# EAGLE design LED Controller (EAGLE 9.6.2)
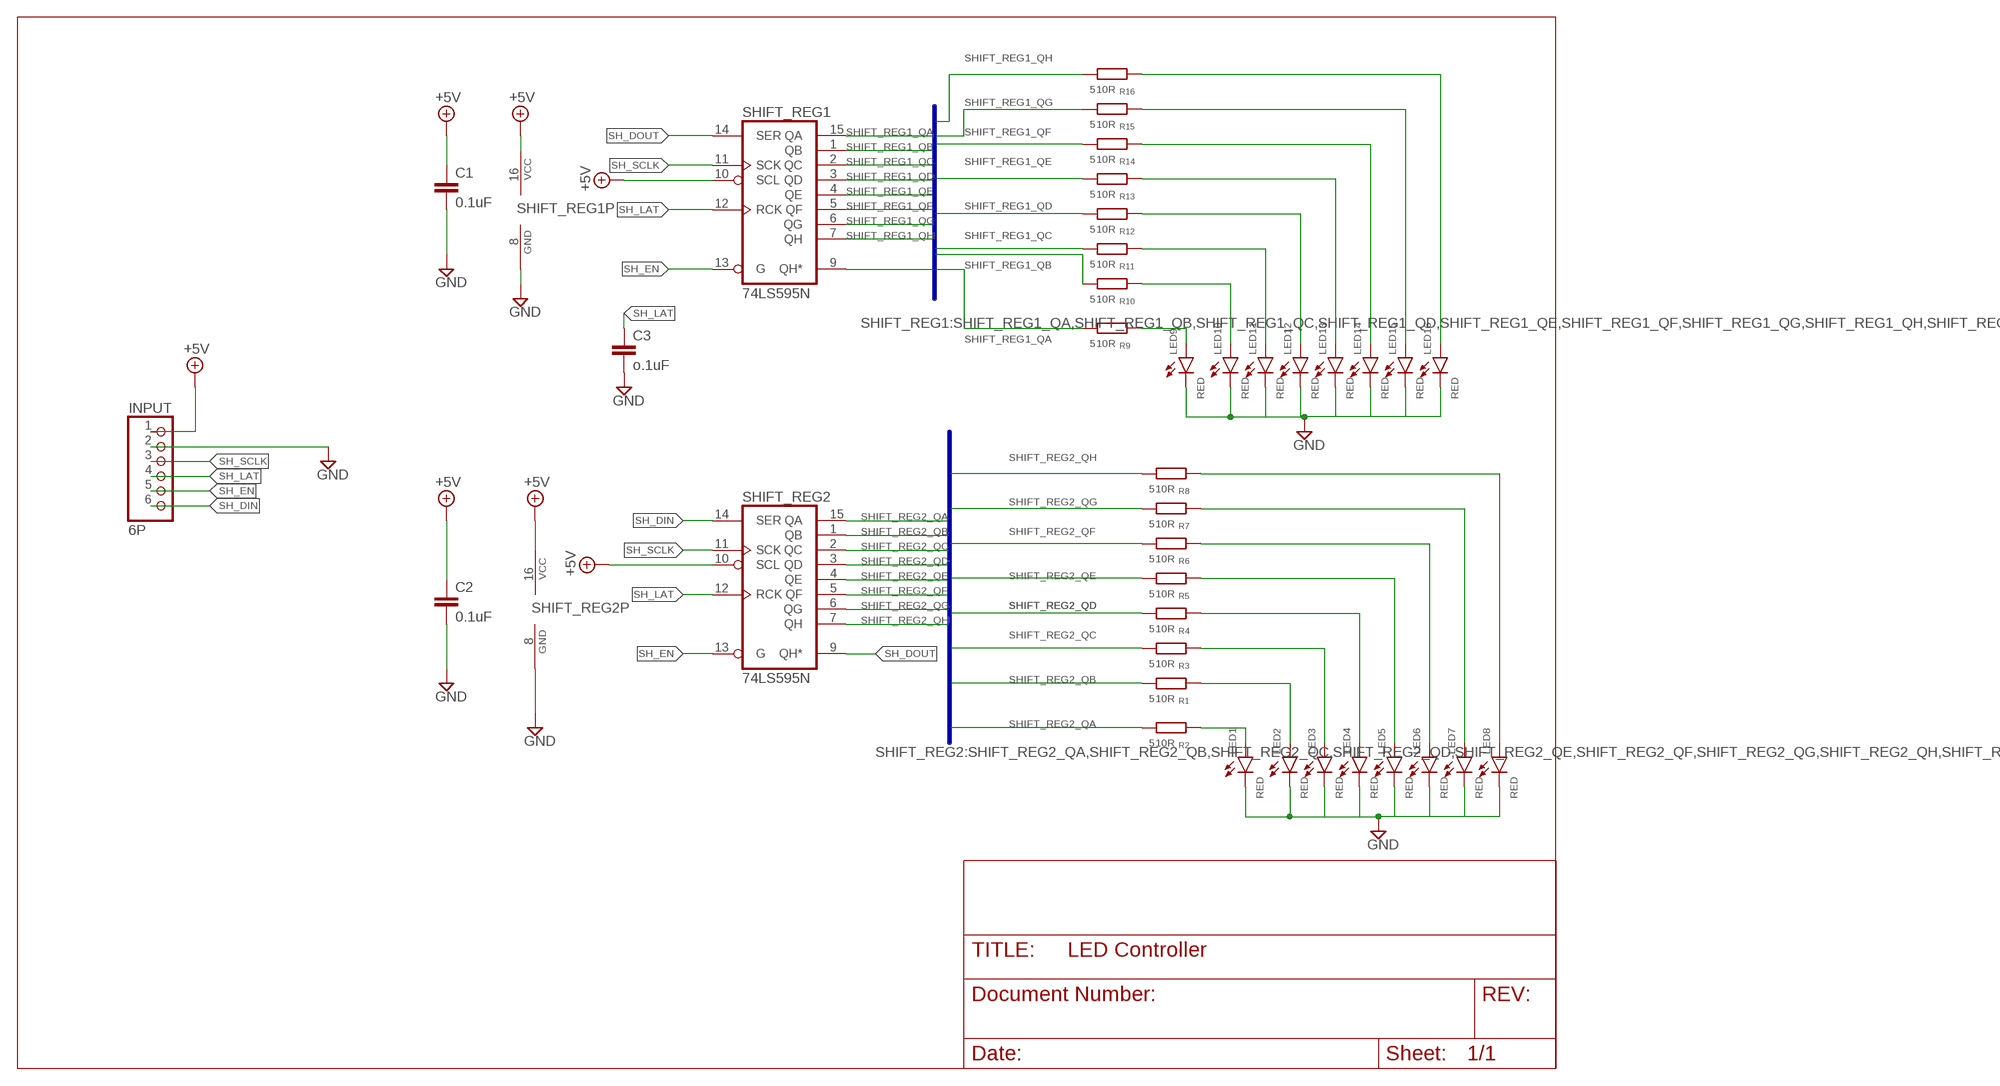
[diagram p0: schematic, sheet 1]

## Parts
C1  0.1uF  C-EU050-030X075  [C050-030X075]
C2  0.1uF  C-EU050-030X075  [C050-030X075]
C3  o.1uF  C-EU050-030X075  [C050-030X075]
INPUT  6P  PINHD-1X6/90  [1X06/90]
LED1  RED  LED5MM  [LED5MM]
LED2  RED  LED5MM  [LED5MM]
LED3  RED  LED5MM  [LED5MM]
LED4  RED  LED5MM  [LED5MM]
LED5  RED  LED5MM  [LED5MM]
LED6  RED  LED5MM  [LED5MM]
LED7  RED  LED5MM  [LED5MM]
LED8  RED  LED5MM  [LED5MM]
LED9  RED  LED5MM  [LED5MM]
LED10  RED  LED5MM  [LED5MM]
LED11  RED  LED5MM  [LED5MM]
LED12  RED  LED5MM  [LED5MM]
LED13  RED  LED5MM  [LED5MM]
LED14  RED  LED5MM  [LED5MM]
LED15  RED  LED5MM  [LED5MM]
LED16  RED  LED5MM  [LED5MM]
R1  510R  R-EU_0207/10  [0207/10]
R2  510R  R-EU_0207/10  [0207/10]
R3  510R  R-EU_0207/10  [0207/10]
R4  510R  R-EU_0207/10  [0207/10]
R5  510R  R-EU_0207/10  [0207/10]
R6  510R  R-EU_0207/10  [0207/10]
R7  510R  R-EU_0207/10  [0207/10]
R8  510R  R-EU_0207/10  [0207/10]
R9  510R  R-EU_0207/10  [0207/10]
R10  510R  R-EU_0207/10  [0207/10]
R11  510R  R-EU_0207/10  [0207/10]
R12  510R  R-EU_0207/10  [0207/10]
R13  510R  R-EU_0207/10  [0207/10]
R14  510R  R-EU_0207/10  [0207/10]
R15  510R  R-EU_0207/10  [0207/10]
R16  510R  R-EU_0207/10  [0207/10]
SHIFT_REG1  74LS595N  [DIL16]
SHIFT_REG2  74LS595N  [DIL16]

## Nets
+5V [POWER]: C1.1 C2.1 INPUT.1 SHIFT_REG1.10(SCL) SHIFT_REG1.16(VCC) SHIFT_REG2.10(SCL) SHIFT_REG2.16(VCC)
GND [POWER]: C1.2 C2.2 C3.2 INPUT.2 LED1.K(C) LED2.K(C) LED3.K(C) LED4.K(C) LED5.K(C) LED6.K(C) LED7.K(C) LED8.K(C) LED9.K(C) LED10.K(C) LED11.K(C) LED12.K(C) LED13.K(C) LED14.K(C) LED15.K(C) LED16.K(C) SHIFT_REG1.8(GND) SHIFT_REG2.8(GND)
N$1: LED9.A R9.2
N$2: LED10.A R10.2
N$3: LED11.A R11.2
N$4: LED12.A R12.2
N$5: LED13.A R13.2
N$6: LED14.A R14.2
N$7: LED15.A R15.2
N$8: LED16.A R16.2
N$9: LED1.A R2.2
N$10: LED2.A R1.2
N$11: LED3.A R3.2
N$12: LED4.A R4.2
N$13: LED5.A R5.2
N$14: LED6.A R6.2
N$15: LED7.A R7.2
N$16: LED8.A R8.2
SH_DIN: INPUT.6 SHIFT_REG2.14(SER)
SH_DOUT: SHIFT_REG1.14(SER) SHIFT_REG2.9(QH*)
SH_EN: INPUT.5 SHIFT_REG1.13(G) SHIFT_REG2.13(G)
SH_LAT: C3.1 INPUT.4 SHIFT_REG1.12(RCK) SHIFT_REG2.12(RCK)
SH_SCLK: INPUT.3 SHIFT_REG1.11(SCK) SHIFT_REG2.11(SCK)
SHIFT_REG1_QA: R9.1 SHIFT_REG1.15(QA)
SHIFT_REG1_QB: R10.1 SHIFT_REG1.1(QB)
SHIFT_REG1_QC: R11.1 SHIFT_REG1.2(QC)
SHIFT_REG1_QD: R12.1 SHIFT_REG1.3(QD)
SHIFT_REG1_QE: R13.1 SHIFT_REG1.4(QE)
SHIFT_REG1_QF: R14.1 SHIFT_REG1.5(QF)
SHIFT_REG1_QG: R15.1 SHIFT_REG1.6(QG)
SHIFT_REG1_QH: R16.1 SHIFT_REG1.7(QH)
SHIFT_REG1_QH*: SHIFT_REG1.9(QH*)
SHIFT_REG2_QA: R2.1 SHIFT_REG2.15(QA)
SHIFT_REG2_QB: R1.1 SHIFT_REG2.1(QB)
SHIFT_REG2_QC: R3.1 SHIFT_REG2.2(QC)
SHIFT_REG2_QD: R4.1 SHIFT_REG2.3(QD)
SHIFT_REG2_QE: R5.1 SHIFT_REG2.4(QE)
SHIFT_REG2_QF: R6.1 SHIFT_REG2.5(QF)
SHIFT_REG2_QG: R7.1 SHIFT_REG2.6(QG)
SHIFT_REG2_QH: R8.1 SHIFT_REG2.7(QH)

## Buses
SHIFT_REG1:SHIFT_REG1_QA,SHIFT_REG1_QB,SHIFT_REG1_QC,SHIFT_REG1_QD,SHIFT_REG1_QE,SHIFT_REG1_QF,SHIFT_REG1_QG,SHIFT_REG1_QH,SHIFT_REG1_QH*
SHIFT_REG2:SHIFT_REG2_QA,SHIFT_REG2_QB,SHIFT_REG2_QC,SHIFT_REG2_QD,SHIFT_REG2_QE,SHIFT_REG2_QF,SHIFT_REG2_QG,SHIFT_REG2_QH,SHIFT_REG2_QH*

## Library data of the parts
C1-C3 = rcl:C-EU: CAPACITOR, European symbol; SPICEPREFIX: C
INPUT = pinhead:PINHD-1X6: PIN HEADER
LED1-LED16 = led:LED: LED OSRAM: - CHIPLED LG R971, LG N971, LY N971, LG Q971, LY Q971, LO R971, LY R971 LH N974, LH R974 LS Q976, LO Q976, LY Q976 LO Q996 - Hyper CHIPLED LW Q18S LB Q993, LB Q99A, LB R99A - SideLED LS A670, LO A670, LY A670, LG A670, LP A670 LB A673, LV A673, LT A673, LW A673 LH A674 LY A675 LS A676, LA A676, LO A676, LY A676, LW A676 LS A679, LY A679, LG A679 - Hyper Micro SIDELED® LS Y876, LA Y876, LO Y876, LY Y876 LT Y87S - SmartLED LW L88C, LW L88S LB L89C, LB L89S, LG L890 LS L89K, LO L89K, LY L89K LS L896, LA L896, LO L896, LY L896 - TOPLED LS T670, LO T670, LY T670, LG T670, LP T670 LSG T670, LSP T670, LSY T670, LOP T670, LYG T670 LG T671, LOG T671, LSG T671 LB T673, LV T673, LT T673, LW T673 LH T674 LS T676, LA T676, LO T676, LY T676, LB T676, LH T676, LSB T676, LW T676 LB T67C, LV T67C, LT T67C, LS T67K, LO T67K, LY T67K, LW E67C LS E67B, LA E67B, LO E67B, LY E67B, LB E67C, LV E67C, LT E67C LW T67C LS T679, LY T679, LG T679 LS T770, LO T770, LY T770, LG T770, LP T770 LB T773, LV T773, LT T773, LW T773 LH T774 LS E675, LA E675, LY E675, LS T675 LS T776, LA T776, LO T776, LY T776, LB T776 LHGB T686 LT T68C, LB T68C - Hyper Mini TOPLED® LB M676 - Mini TOPLED Santana® LG M470 LS M47K, LO M47K, LY M47K Source: http://www.osram.convergy.de LUXEON: - LUMILED® LXK2-PW12-R00, LXK2-PW12-S00, LXK2-PW14-U00, LXK2-PW14-V00 LXK2-PM12-R00, LXK2-PM12-S00, LXK2-PM14-U00 LXK2-PE12-Q00, LXK2-PE12-R00, LXK2-PE12-S00, LXK2-PE14-T00, LXK2-PE14-U00 LXK2-PB12-K00, LXK2-PB12-L00, LXK2-PB12-M00, LXK2-PB14-N00, LXK2-PB14-P00, LXK2-PB14-Q00 LXK2-PR12-L00, LXK2-PR12-M00, LXK2-PR14-Q00, LXK2-PR14-R00 LXK2-PD12-Q00, LXK2-PD12-R00, LXK2-PD12-S00 LXK2-PH12-R00, LXK2-PH12-S00 LXK2-PL12-P00, LXK2-PL12-Q00, LXK2-PL12-R00 Source: www.luxeon.com KINGBRIGHT: KA-3528ASYC Source: www.kingbright.com
R1-R16 = rcl:R-EU_: RESISTOR, European symbol; SPICEPREFIX: R
SHIFT_REG1 SHIFT_REG2 = 74xx-us:74*595: 8-bit SHIFT REGISTER, output latch

## Net classes
0 default: width 0.254 mm, drill 0.406 mm, clearance 0.305 mm
1 POWER: width 0.406 mm, drill 0.406 mm, clearance 0.254 mm

## Board
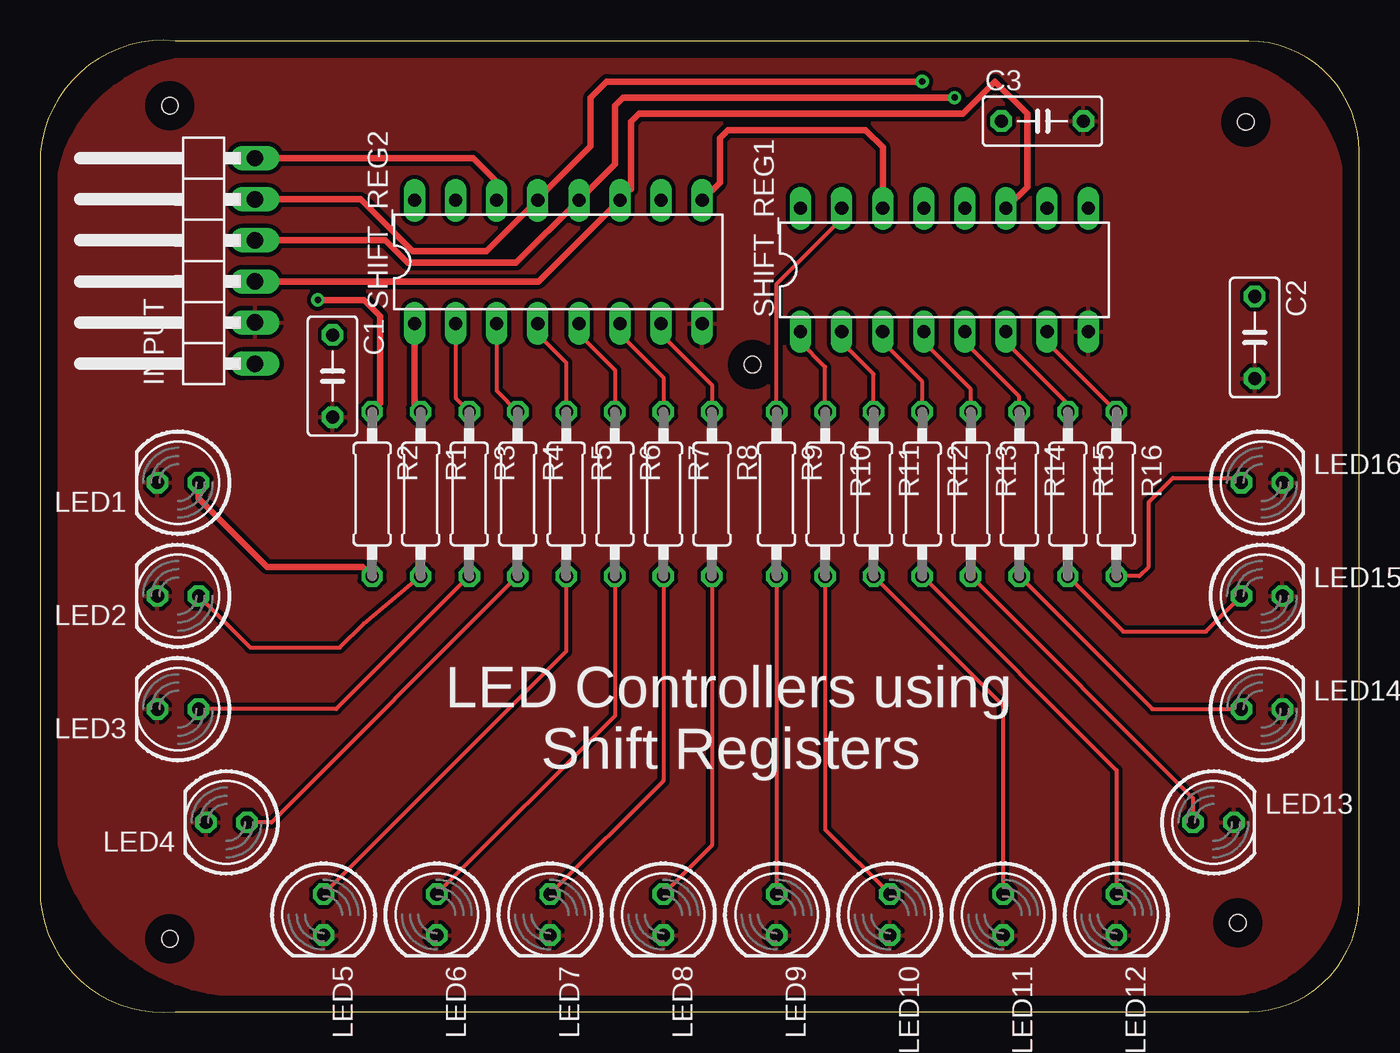
[diagram p1: board, top side]
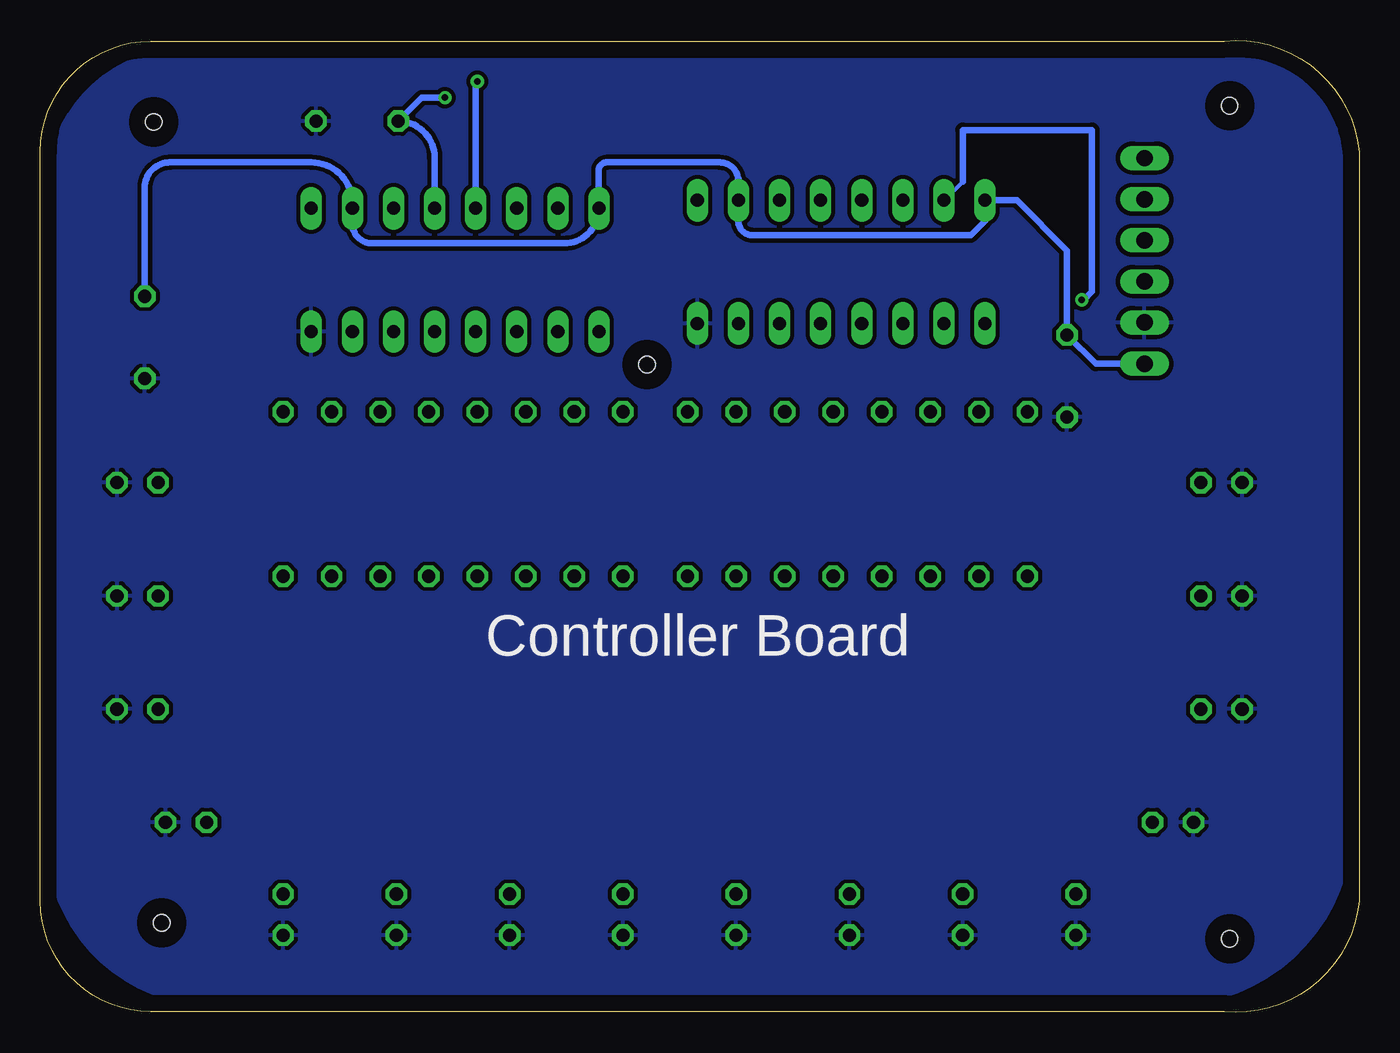
[diagram p2: board, bottom side, seen from below]

Size 81.5 x 60.07 mm. Coordinates in mm from the lower left corner, seen from the top.
Outline: 0,53.21 0,6.86 arc90 8.33,0.04 74.67,0.04 arc90 81.5,6.86 81.5,53.21 arc90 74.67,60.04 8.33,60.04 arc90 0,53.21
Copper layers (1*16): Top 0.035mm / dielectric 1.5mm / Bottom 0.035mm
Design rules "default *": minimum track width 8mil, minimum drill 0.35mm, track to track 8mil, track to pad 8mil, pad to pad 8mil, via to via 8mil, smd to smd 8mil, copper to edge 40mil, drill to drill 6mil, minimum pad ring 10mil, minimum via ring 8mil, stop-mask expansion 4mil, vias tented up to drill 0mil, thermal gap 10mil
Holes 1 mm at 8,56.04 74.5,55.04 8,4.54 74,5.54 44,40.04

### Footprints (pad centres in the part's own frame; a part is rotated, then mirrored left to right if it is on the bottom)
C050-030X075 = drill 0.813 octagon: 1 -2.54,0; 2 2.54,0
1X06/90 = drill 1.016 long: 1 -6.35,-3.81; 2 -3.81,-3.81; 3 -1.27,-3.81; 4 1.27,-3.81; 5 3.81,-3.81; 6 6.35,-3.81
LED5MM = drill 0.813 octagon: A -1.27,0; K 1.27,0
0207/10 = drill 0.813 octagon: 1 -5.08,0; 2 5.08,0
DIL16 = drill 0.813 long: 1 -8.89,-3.81; 2 -6.35,-3.81; 3 -3.81,-3.81; 4 -1.27,-3.81; 5 1.27,-3.81; 6 3.81,-3.81; 7 6.35,-3.81; 8 8.89,-3.81; 9 8.89,3.81; 10 6.35,3.81; 11 3.81,3.81; 12 1.27,3.81; 13 -1.27,3.81; 14 -3.81,3.81; 15 -6.35,3.81; 16 -8.89,3.81

### Placement (x,y rotation side)
C1  18.05,39.33 270 top
C2  75.05,41.72 270 top
C3  61.93,55.09 0 top
INPUT  9.45,46.45 90 top
LED1  8.5,32.74 180 top
LED2  8.5,25.74 180 top
LED3  8.5,18.74 180 top
LED4  11.5,11.74 180 top
LED5  17.5,6.04 270 top
LED6  24.5,6.04 270 top
LED7  31.5,6.04 270 top
LED8  38.5,6.04 270 top
LED9  45.5,6.04 270 top
LED10  52.5,6.04 270 top
LED11  59.5,6.04 270 top
LED12  66.5,6.04 270 top
LED13  72.5,11.74 0 top
LED14  75.5,18.74 0 top
LED15  75.5,25.74 0 top
LED16  75.5,32.74 0 top
R1  23.5,32.04 270 top
R2  20.5,32.04 270 top
R3  26.5,32.04 270 top
R4  29.5,32.04 270 top
R5  32.5,32.04 270 top
R6  35.5,32.04 270 top
R7  38.5,32.04 270 top
R8  41.5,32.04 270 top
R9  45.5,32.04 270 top
R10  48.5,32.04 270 top
R11  51.5,32.04 270 top
R12  54.5,32.04 270 top
R13  57.5,32.04 270 top
R14  60.5,32.04 270 top
R15  63.5,32.04 270 top
R16  66.5,32.04 270 top
SHIFT_REG1  55.87,45.89 0 top
SHIFT_REG2  32.01,46.39 0 top

### Tracks (layer width: path | path; a pad name or v marks a point on that pad's centre or on a via)
+5V
  Bottom 0.406: INPUT.1 16.28,40.1 C1.1 18.05,47.09 21.16,50.2 SHIFT_REG2.16 23.12,48.92 24,48.04 37.5,48.04 arc90 38.36,48.9 SHIFT_REG2.10 38.36,51.4 arc-90 39.5,52.54 46.5,52.54 arc-90 47,52.04 47,49.72 arc-90 SHIFT_REG1.16 arc90 49.14,47.54 61,47.54 arc90 62.22,48.76 SHIFT_REG1.10 62.22,50 arc-90 64.76,52.54 73.5,52.54 arc-90 75.05,50.99 C2.1
GND
  pour Top (isolate 0.254): 16,59.04 72,59.04 arc-90 80.5,50.54 80.5,8.54 arc-90 73,1.04 12.5,1.04 arc-90 1,12.54 1,50.04 arc-90 10,59.04
  pour Bottom (isolate 0.254): 9.5,59.54 72.5,59.54 arc-90 81,51.04 81,49.54 81,10.54 arc-90 71,0.54 11.5,0.54 arc-90 0.5,11.54 0.5,13.04 0.5,52.54 arc-90 7.5,59.54
N$1
  Top 0.254: R9.2 LED9.A
N$2
  Top 0.254: LED10.A 48.5,11.31 R10.2
N$3
  Top 0.254: LED11.A 59.5,18.96 R11.2
N$4
  Top 0.254: LED12.A 66.5,14.96 R12.2
N$5
  Top 0.254: LED13.A 71.23,13.23 R13.2
N$6
  Top 0.254: LED14.A 68.72,18.74 R14.2
N$7
  Top 0.254: R15.2 66.92,23.54 72.03,23.54 LED15.A
N$8
  Top 0.254: R16.2 67.92,26.96 68.5,27.54 68.5,31.54 70,33.04 73.93,33.04 LED16.A
N$9
  Top 0.406: R2.2 19.92,27.54 14,27.54 9.77,31.77 LED1.A
N$10
  Top 0.254: LED2.A 12.97,22.54 18.5,22.54 20,24.04 R1.2
N$11
  Top 0.254: LED3.A 18.28,18.74 R3.2
N$12
  Top 0.254: LED4.A 14.28,11.74 R4.2
N$13
  Top 0.254: LED5.A 32.5,22.31 R5.2
N$14
  Top 0.254: LED6.A 35.5,18.31 R6.2
N$15
  Top 0.254: LED7.A 38.5,14.31 R7.2
N$16
  Top 0.254: LED8.A 41.5,10.31 R8.2
SH_DIN
  Top 0.406: SHIFT_REG2.14 28.2,51.34 26.75,52.79 26.74,52.8 INPUT.6
SH_DOUT
  Top 0.406: SHIFT_REG2.9 42,51.3 42,54.04 42.5,54.54 51,54.54 52.06,53.48 SHIFT_REG1.14
SH_EN  (via drill 0.41)
  Top 0.406: INPUT.5 19.78,50.26 23,47.04 27.58,47.04 SHIFT_REG2.13 30.74,50.28 34,53.54 34,56.54 35,57.54 v54.5,57.54
  Bottom 0.406: v54.5,57.54 54.6,57.44 SHIFT_REG1.13
SH_LAT  (via drill 0.41)
  Top 0.406: INPUT.4 21.31,47.72 22.7,46.33 29.41,46.33 SHIFT_REG2.12 35.5,52.42 35.5,56.04 36,56.54 v56.5,56.54
  Bottom 0.406: v56.5,56.54 57.94,56.54 C3.1 arc90 57.14,52.84 SHIFT_REG1.12
SH_SCLK
  Top 0.254: SHIFT_REG2.11 36.5,50.88
  Top 0.406: INPUT.3 30.8,45.18 SHIFT_REG2.11 | 36.5,50.88 36.5,55.04 37,55.54 57,55.54 59,57.54 61,55.54 61,51.02 SHIFT_REG1.11
SHIFT_REG1_QA
  Top 0.254: R9.1 45.5,45.02 49.52,49.04 SHIFT_REG1.15
SHIFT_REG1_QB
  Top 0.254: R10.1 48.5,39.9 46.98,41.42 SHIFT_REG1.1
SHIFT_REG1_QC
  Top 0.254: R11.1 51.5,39.44 49.52,41.42 SHIFT_REG1.2
SHIFT_REG1_QD
  Top 0.254: R12.1 54.5,38.98 52.06,41.42 SHIFT_REG1.3
SHIFT_REG1_QE
  Top 0.254: R13.1 57.5,38.52 54.6,41.42 SHIFT_REG1.4
SHIFT_REG1_QF
  Top 0.254: R14.1 60.5,38.06 57.14,41.42 SHIFT_REG1.5
SHIFT_REG1_QG
  Top 0.254: R15.1 63.5,37.6 59.68,41.42 SHIFT_REG1.6
SHIFT_REG1_QH
  Top 0.254: R16.1 66.5,37.14 62.22,41.42 SHIFT_REG1.7
SHIFT_REG2_QA  (via drill 0.41)
  Top 0.406: v17.14,44.04 20,44.04 21,43.04 21,37.62 R2.1
  Bottom 0.254: 24.5,51.36 SHIFT_REG2.15
  Bottom 0.406: 24.5,51.36 24.5,54.54 16.5,54.54 16.5,44.54 17,44.04 v17.14,44.04
SHIFT_REG2_QB
  Top 0.254: 23.12,41.92 SHIFT_REG2.1
  Top 0.406: R1.1 23.12,37.5 23.12,41.92
SHIFT_REG2_QC
  Top 0.254: R3.1 25.66,37.96 SHIFT_REG2.2
SHIFT_REG2_QD
  Top 0.254: R4.1 28.2,38.42 SHIFT_REG2.3
SHIFT_REG2_QE
  Top 0.254: R5.1 32.5,40.16 30.74,41.92 SHIFT_REG2.4
SHIFT_REG2_QF
  Top 0.254: R6.1 35.5,39.7 33.28,41.92 SHIFT_REG2.5
SHIFT_REG2_QG
  Top 0.254: R7.1 38.5,39.24 35.82,41.92 SHIFT_REG2.6
SHIFT_REG2_QH
  Top 0.254: R8.1 41.5,38.78 38.36,41.92 SHIFT_REG2.7

### Text on the board
tNames: LED Controllers using / Shift Registers
bNames: Controller Board